# EasyEDA schematic SCH_DART-Flight-Computer-5_2024-08-18.json
TITLE: DART Flight Computer; REV: 5; Date: 2024-08-17; Sheet: 1/1; Drawn By: Jack O'Hara; Company: DART
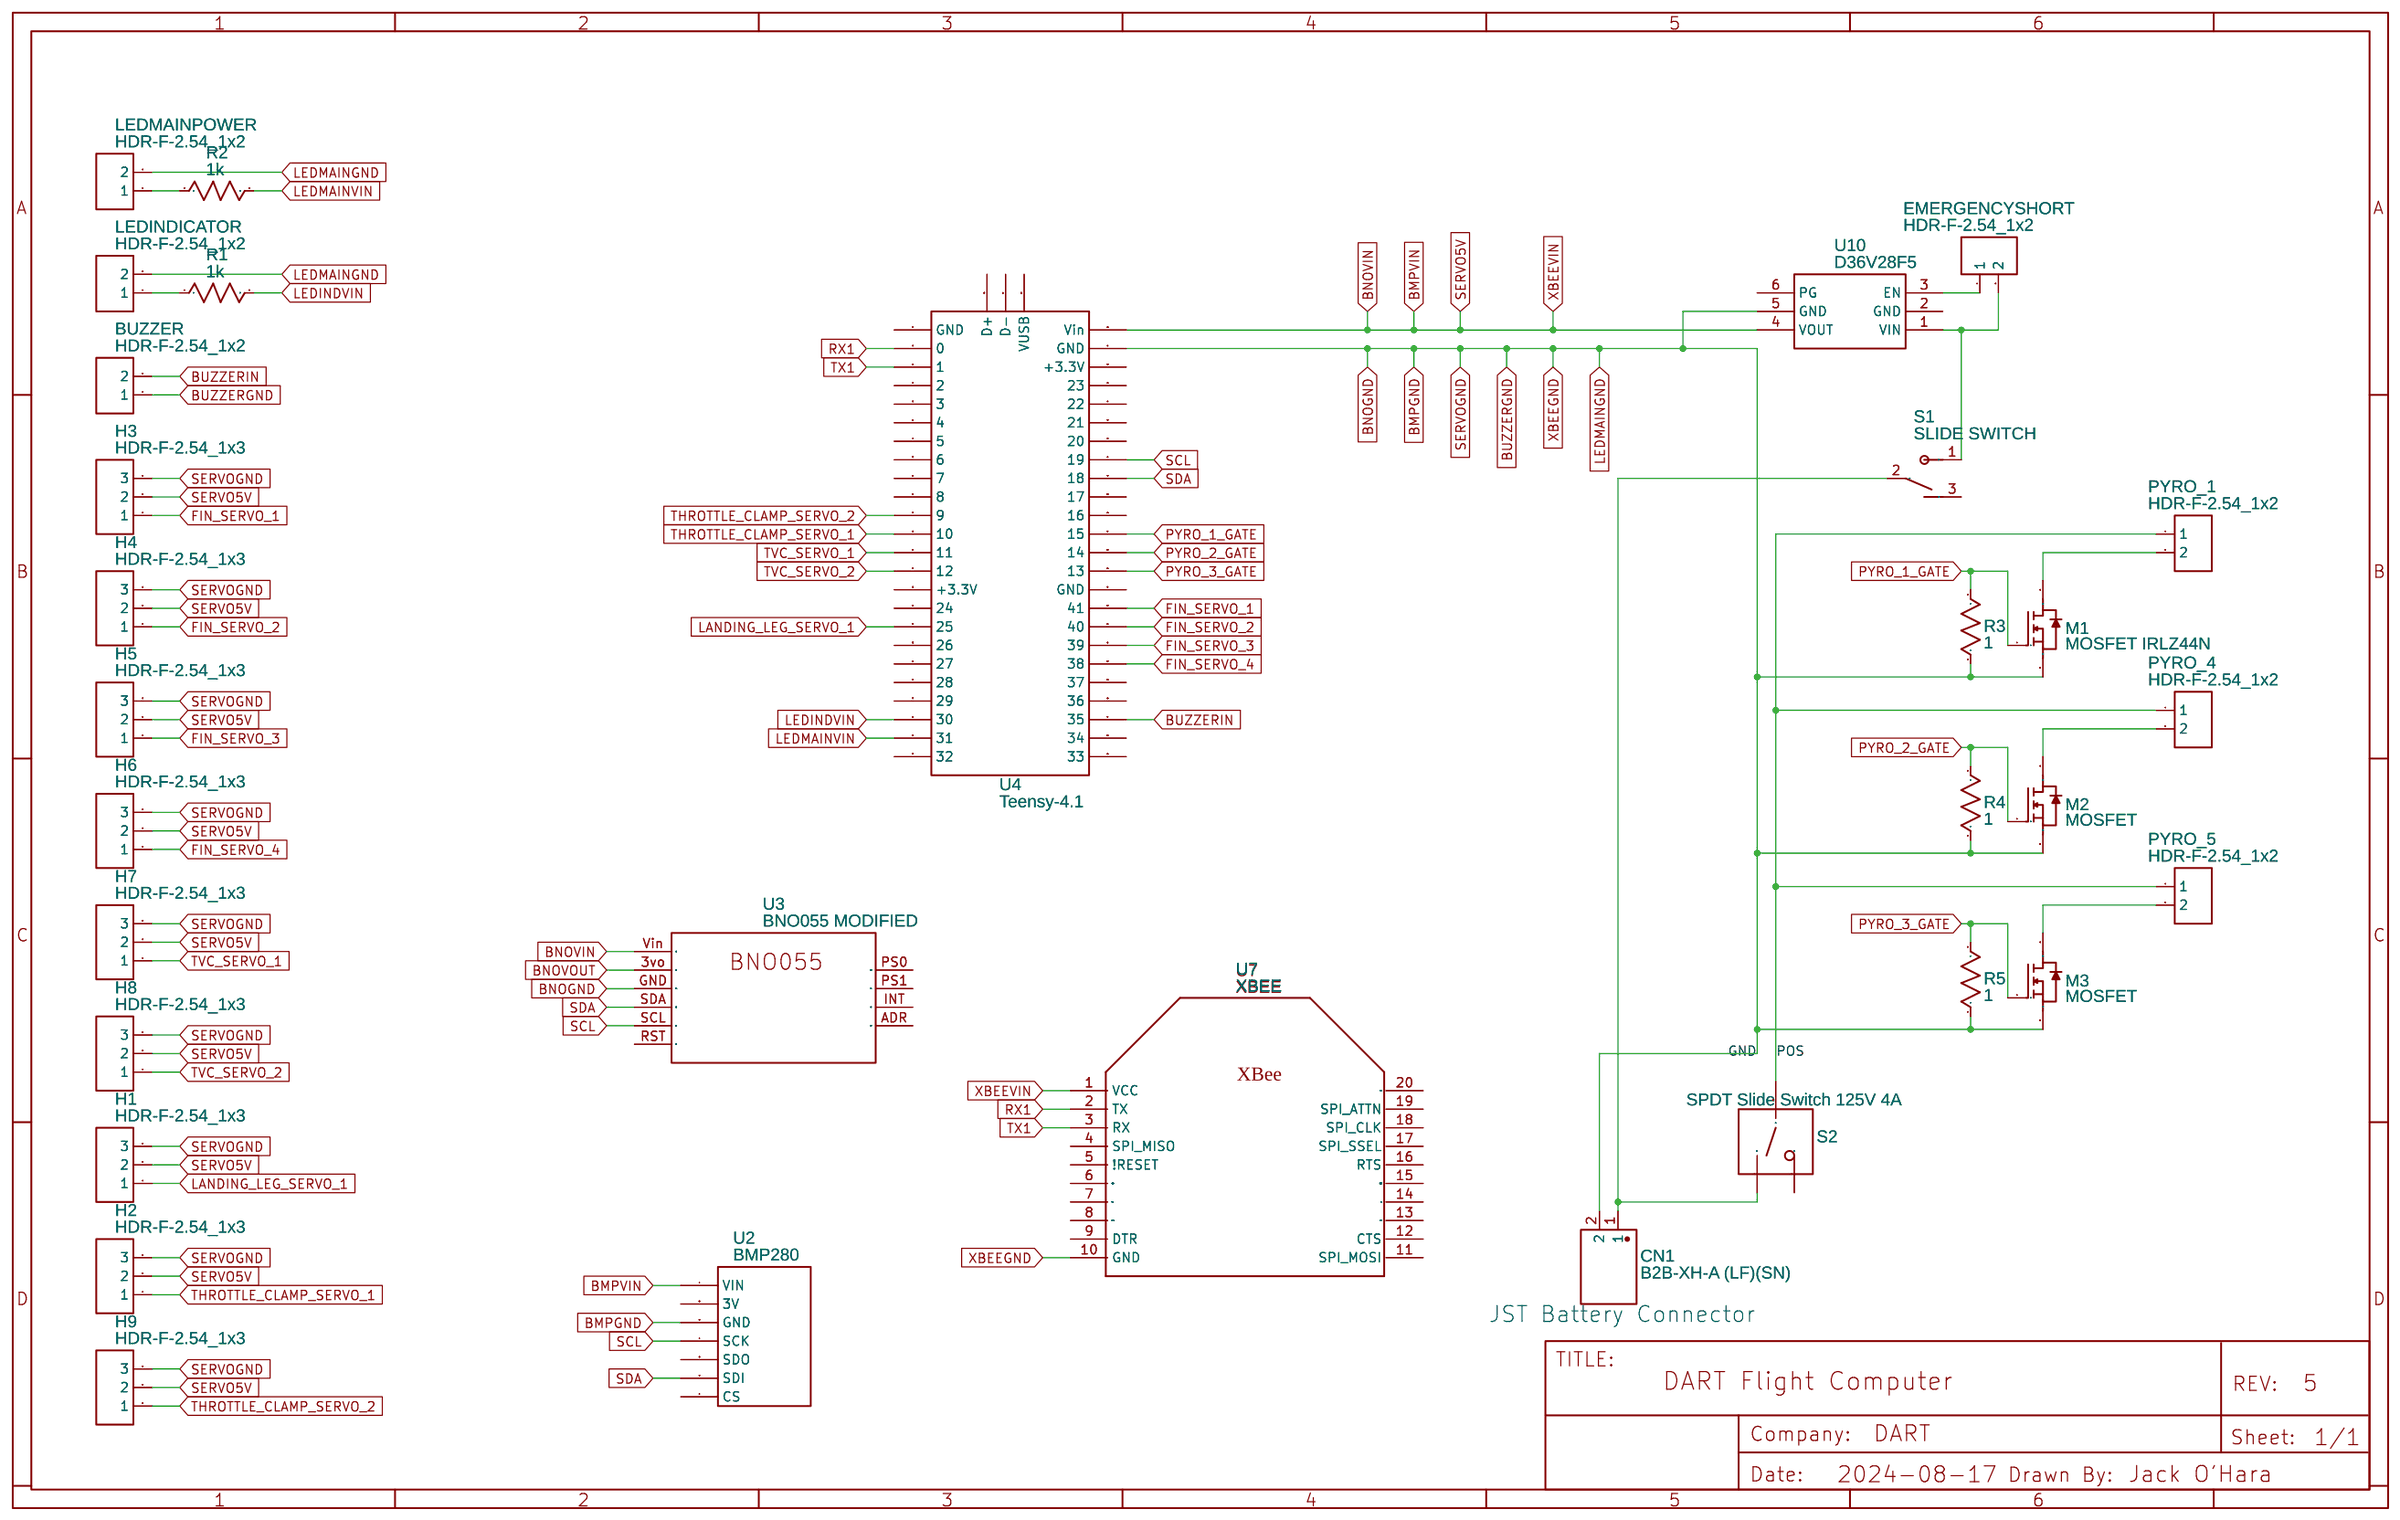
[diagram p0: schematic sheet]

## Parts
BUZZER  HDR-F-2.54_1x2  [HDR-F-2.54_1X2]
CN1  B2B-XH-A (LF)(SN)  [CONN-TH_B2B-XH-A-LF-SN]
EMERGENCYSHORT  HDR-F-2.54_1x2  [HDR-F-2.54_1X2]
H1  HDR-F-2.54_1x3  [HDR-F-2.54_1X3]
H2  HDR-F-2.54_1x3  [HDR-F-2.54_1X3]
H3  HDR-F-2.54_1x3  [HDR-F-2.54_1X3]
H4  HDR-F-2.54_1x3  [HDR-F-2.54_1X3]
H5  HDR-F-2.54_1x3  [HDR-F-2.54_1X3]
H6  HDR-F-2.54_1x3  [HDR-F-2.54_1X3]
H7  HDR-F-2.54_1x3  [HDR-F-2.54_1X3]
H8  HDR-F-2.54_1x3  [HDR-F-2.54_1X3]
H9  HDR-F-2.54_1x3  [HDR-F-2.54_1X3]
LEDINDICATOR  HDR-F-2.54_1x2  [HDR-F-2.54_1X2]
LEDMAINPOWER  HDR-F-2.54_1x2  [HDR-F-2.54_1X2]
M1  MOSFET IRLZ44N  [MOSFET]
M2  MOSFET  [MOSFET]
M3  MOSFET  [MOSFET]
PYRO_1  HDR-F-2.54_1x2  [HDR-F-2.54_1X2]
PYRO_4  HDR-F-2.54_1x2  [HDR-F-2.54_1X2]
PYRO_5  HDR-F-2.54_1x2  [HDR-F-2.54_1X2]
R1  1k  [R0603]
R2  1k  [R0603]
R3  1  [R0603]
R4  1  [R0603]
R5  1  [R0603]
S1  SLIDE SWITCH  [SW_OS102011MS2QN1]
S2  SPDT Slide Switch 125V 4A  [8SS1012-Z]
U2  BMP280  [BMP280YSF BMP280YSF BMP280YSF BMP]
U3  BNO055 MODIFIED  [BNO055]
U4  Teensy-4.1  [TEENSY-4.1-ALL-PINS]
U7  XBEE  [XBEE]
U10  D36V28F5  [D36V28F5]

## Library data of the parts
BUZZER EMERGENCYSHORT LEDINDICATOR LEDMAINPOWER PYRO_1 PYRO_4 PYRO_5 = HDR-F-2.54_1x2: Supplier Part: C49661; Supplier: LCSC; Contributor: LCEDA_Lib
CN1 = B2B-XH-A (LF)(SN): Contributor: LCSC; Supplier: LCSC; Supplier Part: C158012; Manufacturer: JST; Manufacturer Part: B2B-XH-A(LF)(SN); JLCPCB Part Class: Extended Part
H1-H9 = HDR-F-2.54_1x3: Supplier Part: C146690; Supplier: LCSC; Contributor: LCEDA_Lib
M1-M3 = MOSFET: Contributor: Guest
R1-R5 = R_0603_US: Contributor: LCEDA_Lib
S1 = SLIDE SWITCH: Contributor: inffac3
S2 = SPDT Slide Switch 125V 4A: Contributor: godfrey chu; Supplier: Digi-Key; Supplier Part: 563-1621-ND; Manufacturer: Nidec Copal Electronics; link: https://www.digikey.ca/en/products/detail/nidec-copal-electronics/8SS1012-Z/1792126
U2 = BMP280: Contributor: Calibre320
U3 = BNO055 MODIFIED: Contributor: abdussamet28051999
U4 = Teensy-4.1: Contributor: vosegaard
U7 = XBEE: Contributor: signx
U10 = D36V28F5: Manufacturer: Pololu; Manufacturer Part: Pololu D36V28F5 Step-down regulator 5v fixed; Supplier: Pololu; Supplier Part: 3782; link: https://www.pololu.com/product/3782; Contributor: edelarosar1700

## Nets
BMPGND: BUZZER.1 CN1.2 H1.3 H2.3 H3.3 H4.3 H5.3 H6.3 H7.3 H8.3 H9.3 LEDINDICATOR.2 LEDMAINPOWER.2 M1.2 M2.2 M3.2 R3.1 R4.1 R5.1 U2.5(GND) U3.GND U4.47(GND) U7.10(GND) U10.5(GND)
BMPVIN: H1.2 H2.2 H3.2 H4.2 H5.2 H6.2 H7.2 H8.2 H9.2 U2.7(VIN) U3.Vin U4.48(Vin) U7.1(VCC) U10.4(VOUT)
BNOVOUT: U3.3vo
BUZZERIN: BUZZER.2 U4.27(35)
FIN_SERVO_1: H3.1 U4.33(41)
FIN_SERVO_2: H4.1 U4.32(40)
FIN_SERVO_3: H5.1 U4.31(39)
FIN_SERVO_4: H6.1 U4.30(38)
LANDING_LEG_SERVO_1: H1.1 U4.17(25)
LEDINDVIN: R1.2 U4.22(30)
LEDMAINVIN: R2.2 U4.23(31)
POS: PYRO_1.1 PYRO_4.1 PYRO_5.1 S2.2
PYRO_1_GATE: M1.1 R3.2 U4.37(15)
PYRO_2_GATE: M2.1 R4.2 U4.36(14)
PYRO_3_GATE: M3.1 R5.2 U4.35(13)
RX1: U4.2(0) U7.2(TX)
SCL: U2.4(SCK) U3.SCL U4.41(19)
SDA: U2.2(SDI) U3.SDA U4.40(18)
THROTTLE_CLAMP_SERVO_1: H2.1 U4.12(10)
THROTTLE_CLAMP_SERVO_2: H9.1 U4.11(9)
TVC_SERVO_1: H7.1 U4.13(11)
TVC_SERVO_2: H8.1 U4.14(12)
TX1: U4.3(1) U7.3(RX)
Net-(CN1-1): CN1.1 S1.2 S2.3
Net-(EMERGENCYSHORT-1): EMERGENCYSHORT.1 U10.3(EN)
Net-(EMERGENCYSHORT-2): EMERGENCYSHORT.2 S1.1 U10.1(VIN)
Net-(LEDINDICATOR-1): LEDINDICATOR.1 R1.1
Net-(LEDMAINPOWER-1): LEDMAINPOWER.1 R2.1
Net-(M1-3): M1.3 PYRO_1.2
Net-(M2-3): M2.3 PYRO_4.2
Net-(M3-3): M3.3 PYRO_5.2

Not connected (* = marked no-connect by the designer): S1 3; S2 1; U2 1(CS) 3(SDO) 6(3V); U3 ADR INT PS0 PS1 RST; U4 1(GND) 4(2) 5(3) 6(4) 7(5) 8(6) 9(7) 10(8) 15(+3.3V) 16(24) 18(26) 19(27) 20(28) 21(29) 24(32) 25(33) 26(34) 28(36) 29(37) 34(GND) 38(16) 39(17) 42(20) 43(21) 44(22) 45(23) 46(+3.3V) 52(VUSB) 66(D+) 67(D-); U7 4(SPI_MISO) 5(!RESET) 6(PWM0RSSI) 7(PWM1) 8(RESERVED) 9(DTR) 11(SPI_MOSI) 12(CTS) 13(ONSLEEP) 14(VREF) 15(ASCAD5DIO5) 16(RTS) 17(SPI_SSEL) 18(SPI_CLK) 19(SPI_ATTN) 20(AD0DIO0); U10 2(GND) 6(PG)

## Notes on the sheet
- JST Battery Connector
